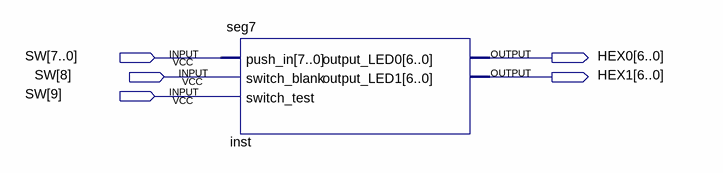
[diagram p0: schematic sheet]
// Quartus schematic seg7_tb.bdf as structural Verilog: 1 symbols, 5 pins
module seg7_tb (
  input  [9:0] SW,
  output [6:0] HEX0,
  output [6:0] HEX1
);

  seg7 inst (.push_in(SW[7:0]), .switch_blank(SW[8]), .switch_test(SW[9]), .output_LED0(HEX0), .output_LED1(HEX1));
endmodule
